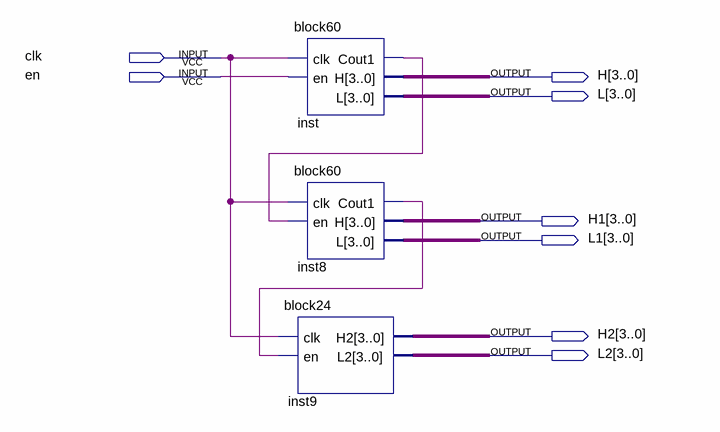
[diagram p0: schematic sheet]
// Quartus schematic timeCounter.bdf as structural Verilog: 3 symbols, 8 pins
module timeCounter (
  input  clk,
  input  en,
  output [3:0] H,
  output [3:0] L,
  output [3:0] H1,
  output [3:0] L1,
  output [3:0] H2,
  output [3:0] L2
);

  wire inst8_cout1, inst_cout1;

  block60 inst (.clk(clk), .en(en), .Cout1(inst_cout1), .H(H), .L(L));
  block60 inst8 (.clk(clk), .en(inst_cout1), .Cout1(inst8_cout1), .H(H1), .L(L1));
  block24 inst9 (.clk(clk), .en(inst8_cout1), .H2(H2), .L2(L2));
endmodule
